# Altium schematic sheet Sensor Connection.SchDoc
size 420 x 297 mm; Address1: Address1; Address2: Address2; Address3: Address3; Address4: Address4; DocumentNumber: АБВГ.123456.001 Э3; SheetNumber: 1; Scale: 1:1; DocumentType: Схема электрическая принципиальная; FirstReferrence: АБВГ.123456.001
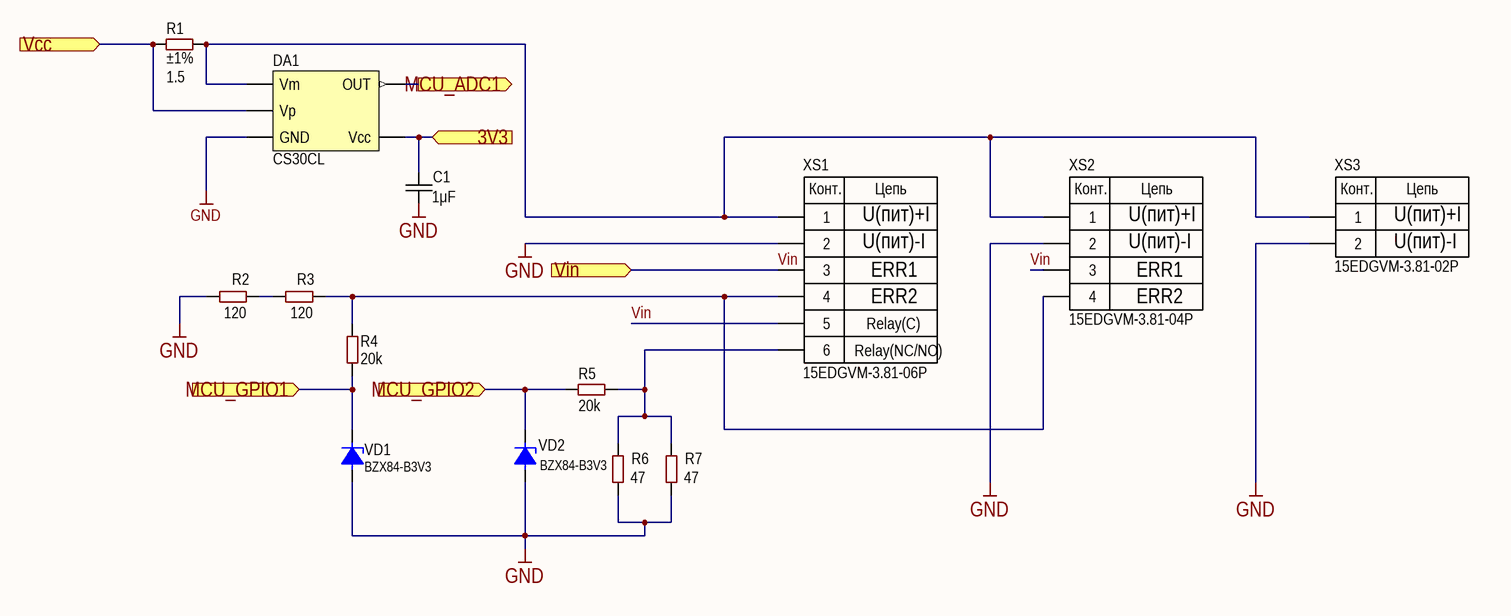
[diagram p0: Sensor Connection.SchDoc]

## Parts
C1  value 1μF  [CAP: 0603]
DA1  CS30CL  [SOT23-5]
R1  value 1.5  Tolerance: ±1%  [RES: 2512]
R2  120  [MFR-2W]
R3  120  [MFR-2W]
R4  value 20k  [RES: 0603]
R5  value 20k  [RES: 0603]
R6  47  [SQP-10]
R7  47  [SQP-10]
VD1  BZX84-B3V3  [SOT23]
VD2  BZX84-B3V3  [SOT23]
XS1  15EDGVM-3.81-06P  [CON: 15EDGVM-3.81-06P]
XS2  15EDGVM-3.81-04P  [CON: 15EDGVM-3.81-04P]
XS3  15EDGVM-3.81-02P  [CON: 15EDGVM-3.81-02P]

## Ports
3V3 (in), MCU_ADC1 (out), MCU_GPIO1 (in), MCU_GPIO2 (in), Vcc (in), Vin (in)

## Nets
GND: C1.1 DA1.2(GND) R2.1 R6.1 R7.1 VD1.1 VD2.1 XS1.2 XS2.2 XS3.2
3V3: C1.2 DA1.5(Vcc) ; port 3V3
MCU_ADC1: DA1.1(OUT) ; port MCU_ADC1
MCU_GPIO1: R4.1 VD1.2 ; port MCU_GPIO1
MCU_GPIO2: R5.1 VD2.2 ; port MCU_GPIO2
Vcc: DA1.3(Vp) R1.1 ; port Vcc
Vin: XS1.3 XS1.5 XS2.3 ; port Vin
NetDA1_4: DA1.4(Vm) R1.2 XS1.1 XS2.1 XS3.1
NetR2_2: R2.2 R3.1
NetR3_2: R3.2 R4.2 XS1.4 XS2.4
NetR5_2: R5.2 R6.2 R7.2 XS1.6

## Notes on the sheet
- U(пит)+I
- U(пит)-I
- ERR1
- ERR2
- Двухватные резисторы,
  выделяется по 1.2 Вата на каждом.
- (near XS1) Relay(NC/NO)
- Relay(C)
- (near VD1) Десятиватные резисторы,
  Выделяется примерно по 12 Вт на каждом
- Перв. примен.
- Справ. №
- Подп. и дата
- Инв. № дубл.
- Взам. инв. №
- Разраб.
- Изм.
- Лист
- № докум.
- Подп.
- Дата
- Лит.
- Масса
- Масштаб
- Пров.
- Т.контр.
- Листов
- Инв. № подл.
- Утв.
- Н.контр.
- 2.106-A3
- Копировал
- Формат А3
- (in symbol 15EDGVM-3.81-02P) Конт.; Цепь
- (in symbol 15EDGVM-3.81-04P) Конт.; Цепь
- (in symbol 15EDGVM-3.81-06P) Конт.; Цепь

## Library data of the parts
C1 = Ceramic_0603: Manufacturer: Yageo; PartNumber: CC0603KRX7R7BB104; ValueManufacturerPartNumber: Ceramic capacitor, 1μF, X7R, ±10%, 16V, 0603, -55...+125°C; TypeCapacitor: Ceramic capacitor; Tolerance: ±10%; TypeDielectric: X7R; Voltage: 16V; Package: 0603; HelpURL: https://www.digikey.com/product-detail/en/yageo/CC0603KRX7R7BB104/311-1088-1-ND/302998; Temperature: -55...+125°C
DA1 = CS30CL: High side current sense high voltage op amp; ComponentLink1Description: Datasheet; ComponentLink1URL: https://www.st.com/resource/en/datasheet/cs30.pdf
R1 = Resistor_2512: Manufacturer: Yageo; PartNumber: RC2512JK-07100RL; ValueManufacturerPartNumber: Resistor film, 1.5, ±1%, 2512, 1W, -55...+125°C; TypeResistor: Resistor film; Power: 1W; Package: 2512; HelpURL: https://www.digikey.com/product-detail/en/yageo/RC2512JK-07100RL/YAG3393CT-ND/5962215; Temperature: -55...+125°C
R2 R3 = Resistor_DIP_2W: MFR200JT-73- 120R; ComponentLink1Description: Datasheet; ComponentLink1URL: https://www.yageo.com/upload/media/product/productsearch/datasheet/lr/YAGEO%20MFR_datasheet_2021v0.pdf
R4 R5 = Resistor_0603: Manufacturer: Yageo; PartNumber: RC0603JR-07100RL; ValueManufacturerPartNumber: Resistor film, 20k, ±5%, 0603, 0.1W, -55...+125°C; TypeResistor: Resistor film; Power: 0.1W; Tolerance: ±5%; Package: 0603; HelpURL: https://www.digikey.com/product-detail/en/yageo/RC0603JR-07100RL/311-100GRCT-ND/729644; Temperature: -55...+125°C
R6 R7 = SQP-10W: SQP10AJB-47R; ComponentLink1Description: Datasheet; ComponentLink1URL: https://www.yageo.com/upload/media/product/productsearch/datasheet/lr/YAGEO%20SQP_NSP_datasheet_2021v0.pdf
VD1 VD2 = BZX84-B3V3: ComponentLink1Description: Datasheet; ComponentLink1URL: https://www.nexperia.com/products/diodes/automotive-diodes/automotive-zener-diodes/BZX84-B3V3.html
XS1 = 15EDGVM-3.81-06P: ComponentLink1Description: Datasheet; ComponentLink1URL: https://www.phoenixcontact.com/online/portal/ru/?uri=pxc-oc-itemdetail:pid=1830635&library=&pcck=P-11-02-11&tab=1&selectedCategory=ALL
XS2 = 15EDGVM-3.81-04P: ComponentLink1Description: Datasheet; ComponentLink1URL: http://files.xn--e1agecchai.xn--p1ai/pdf/15edgvm-3.81.pdf
XS3 = 15EDGVM-3.81-02P: ComponentLink1Description: Datasheet; ComponentLink1URL: http://files.xn--e1agecchai.xn--p1ai/pdf/15edgvm-3.81.pdf